# EAGLE design Jaw_Expansion_Board_V1_0 (2) (EAGLE 8.2.2)
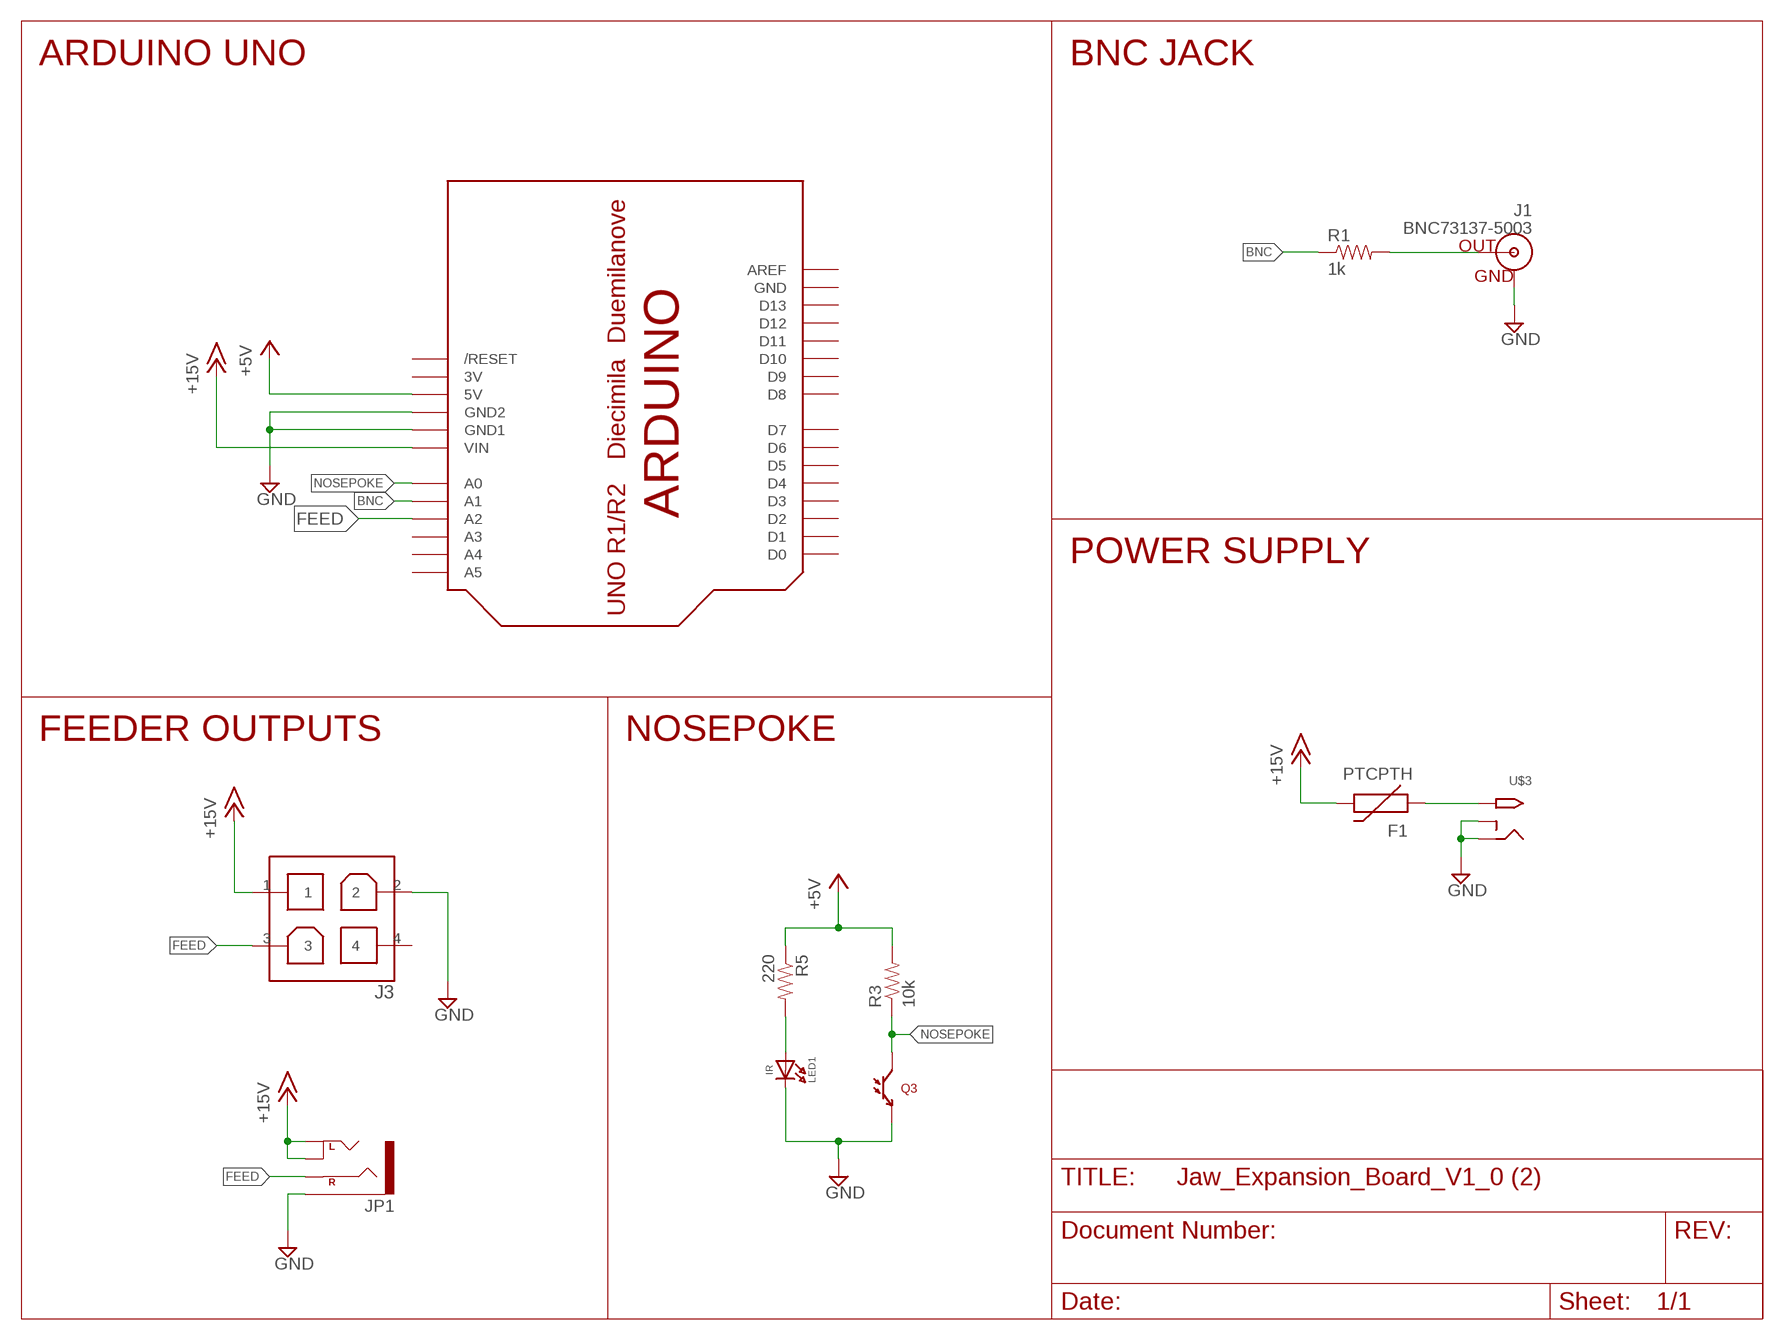
[diagram p0: schematic, sheet 1]

## Parts
F1  PTCPTH  [PTC]
J1  BNC73137-5003  [BNC_73137-5003]
J3  MOLEX_MINI-FIT_MALE_HEADER_2X2MOLEX_87427_MINI-FIT_2X2_RA  [MOLEX_87427_MINI-FIT_2X2_RA]
JP1  3.5MM_STEREORA  [161-3509-E]
LED1  IR  LTR-302  [LTR-301]
Q3  LTR-301  [LTR-301]
R1  1k  RESISTORPTH-1/4W  [AXIAL-0.4]
R3  10k  RESISTORPTH-1/4W  [AXIAL-0.4]
R5  220  RESISTORPTH-1/4W  [AXIAL-0.4]
U$1  ARDUINO_UNOUNO_NO_HOLES  [ARDUINO-NOHOLE]
U$3  2.1MMJACKTHM  [PJ-102A]

## Nets
+5V: R3.P$2 R5.P$1 U$1.5V
+15V [15V]: F1.P$2 J3.1 JP1.L2(LEFT2) JP1.L(LEFT1) U$1.VIN
BNC: R1.P$1 U$1.A1
FEED: J3.3 JP1.R(RIGHT) U$1.A2
GND: J1.GND J3.2 JP1.SHD LED1.-(C) Q3.-(E) U$1.GND1 U$1.GND2 U$3.RING U$3.RING_SW
N$1: J1.S(OUT) R1.P$2
N$3 [15V]: F1.P$1 U$3.TIP
N$6: LED1.+(A) R5.P$2
NOSEPOKE: Q3.+(C) R3.P$1 U$1.A0
Unconnected: J3.4 U$1.A3 U$1.A4 U$1.A5 U$1.AREF U$1.D0 U$1.D1 U$1.D2 U$1.D3 U$1.D4 U$1.D5 U$1.D6 U$1.D7 U$1.D8 U$1.D9 U$1.D10 U$1.D11 U$1.D12 U$1.D13 U$1.RESET(/RESET)

## Notes on the sheet
- ARDUINO UNO | BNC JACK
- POWER SUPPLY
- FEEDER OUTPUTS | NOSEPOKE

## Power pins joined to a net without a drawn wire
3V: U$1.3V
GND: U$1.GND

## Library data of the parts
F1 = SparkFun-PowerIC:PTC: Resettable Fuse PTC Resettable Fuse. Spark Fun Electronics SKU : COM-08357
J1 = vulintus:BNC: BNC Connector, Mouser Part# 5227161
J3 = vulintus:MOLEX_MINI-FIT_MALE_HEADER_2X2: Molex Mini-Fit Jr. Header, 4.20mm Pitch, Vertical, with Flange, 4 Circuits, without Mounting Flanges Part Number: 87427-0444
JP1 = vulintus:3.5MM_STEREO: 3.5mm Audio Jack Simple 3.5mm common PCB mount audio jack. Variant PTH is our storefront SKU PRT-08032
LED1 = vulintus:LTR-302: Through-hole side-sending IR emitter Pairs with IR phototransistoLTR-301
Q3 = vulintus:LTR-301: Through-hole side-receiving IR phototransistor Pairs with IR emitter LTR-302
R1 R3 R5 = vulintus:RESISTOR: Resistor Basic schematic elements and footprints for 0603, 1206, and PTH resistors.
U$1 = vulintus:ARDUINO_UNO: Arduino Diecimila/Duemilanove Make a shield with ease, this package has all the named pins as well as the two mounting drill holes and an outline of the USB and DC power connector. The outline is on the DIMENSION layer, so if your board house uses it they will cut the outline to match. http://www.ladyada.net/library/pcb/eaglelibrary.html
U$3 = vulintus:2.1MMJACK: 2.1mm x 5.5mm THM DC jack with internal switch. Digikey part #PJ-102A, 4UCON part #05537 2.1mm x 5.5mm SMT DC jack with internal switch. Digikey part #PJ-002A-SMT, 4UCON part #03267 By microbuilder.eu & adafruit.com

## Net classes
0 default: width 1.016 mm
1 15V: width 1.016 mm

## Board
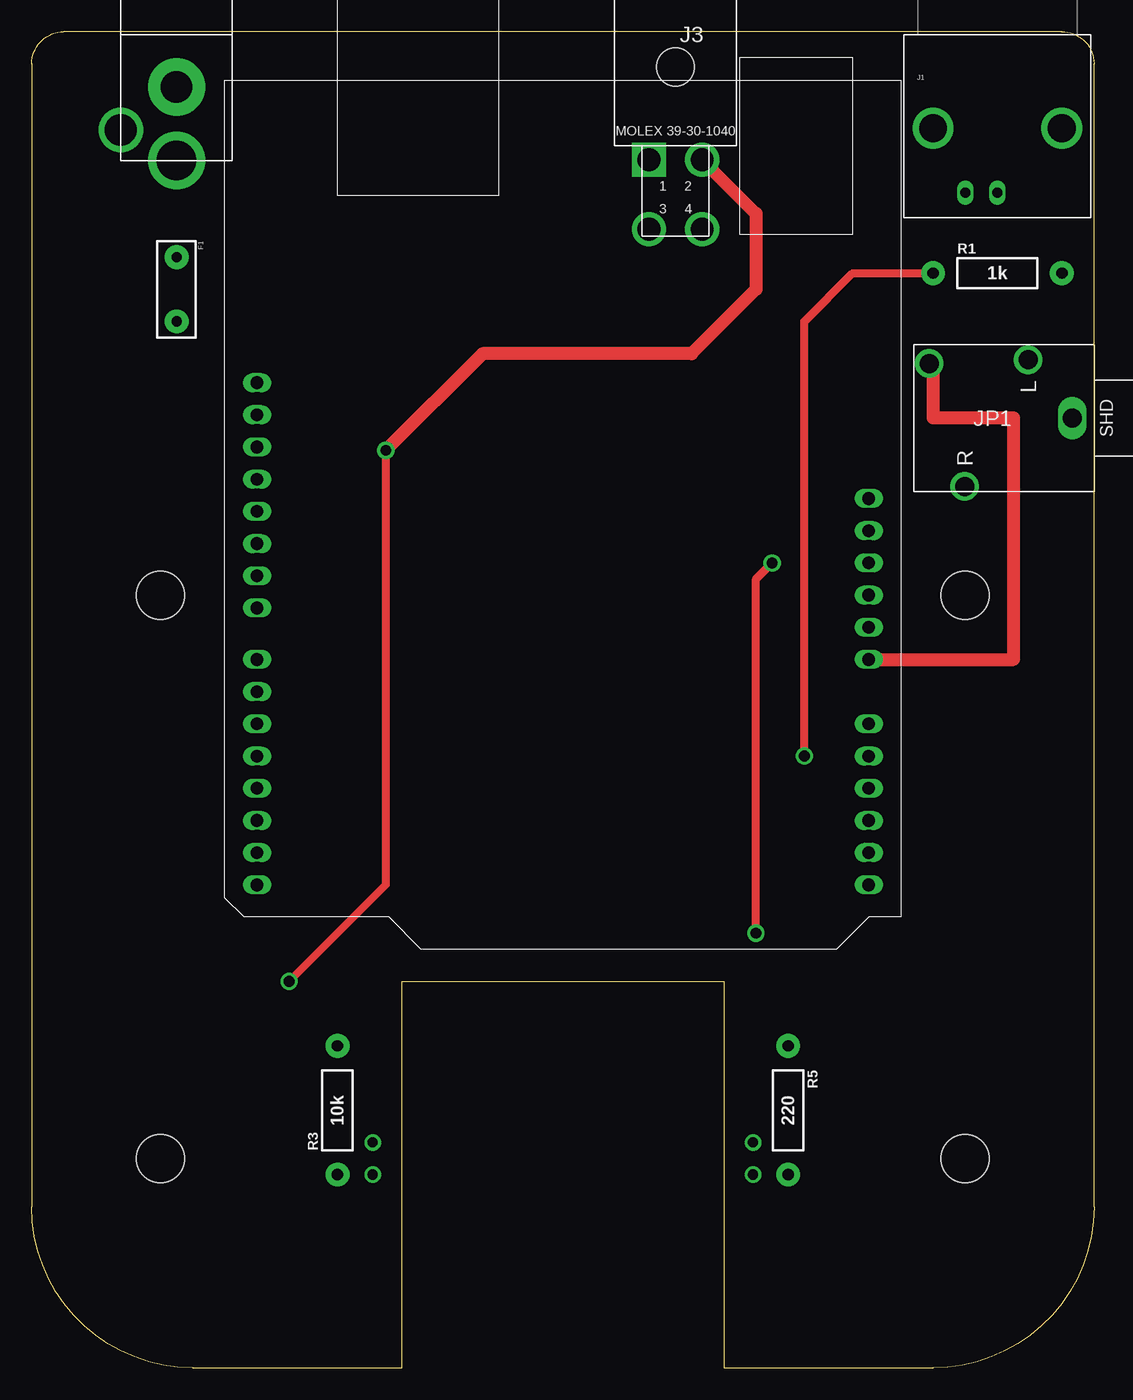
[diagram p1: board, top side]
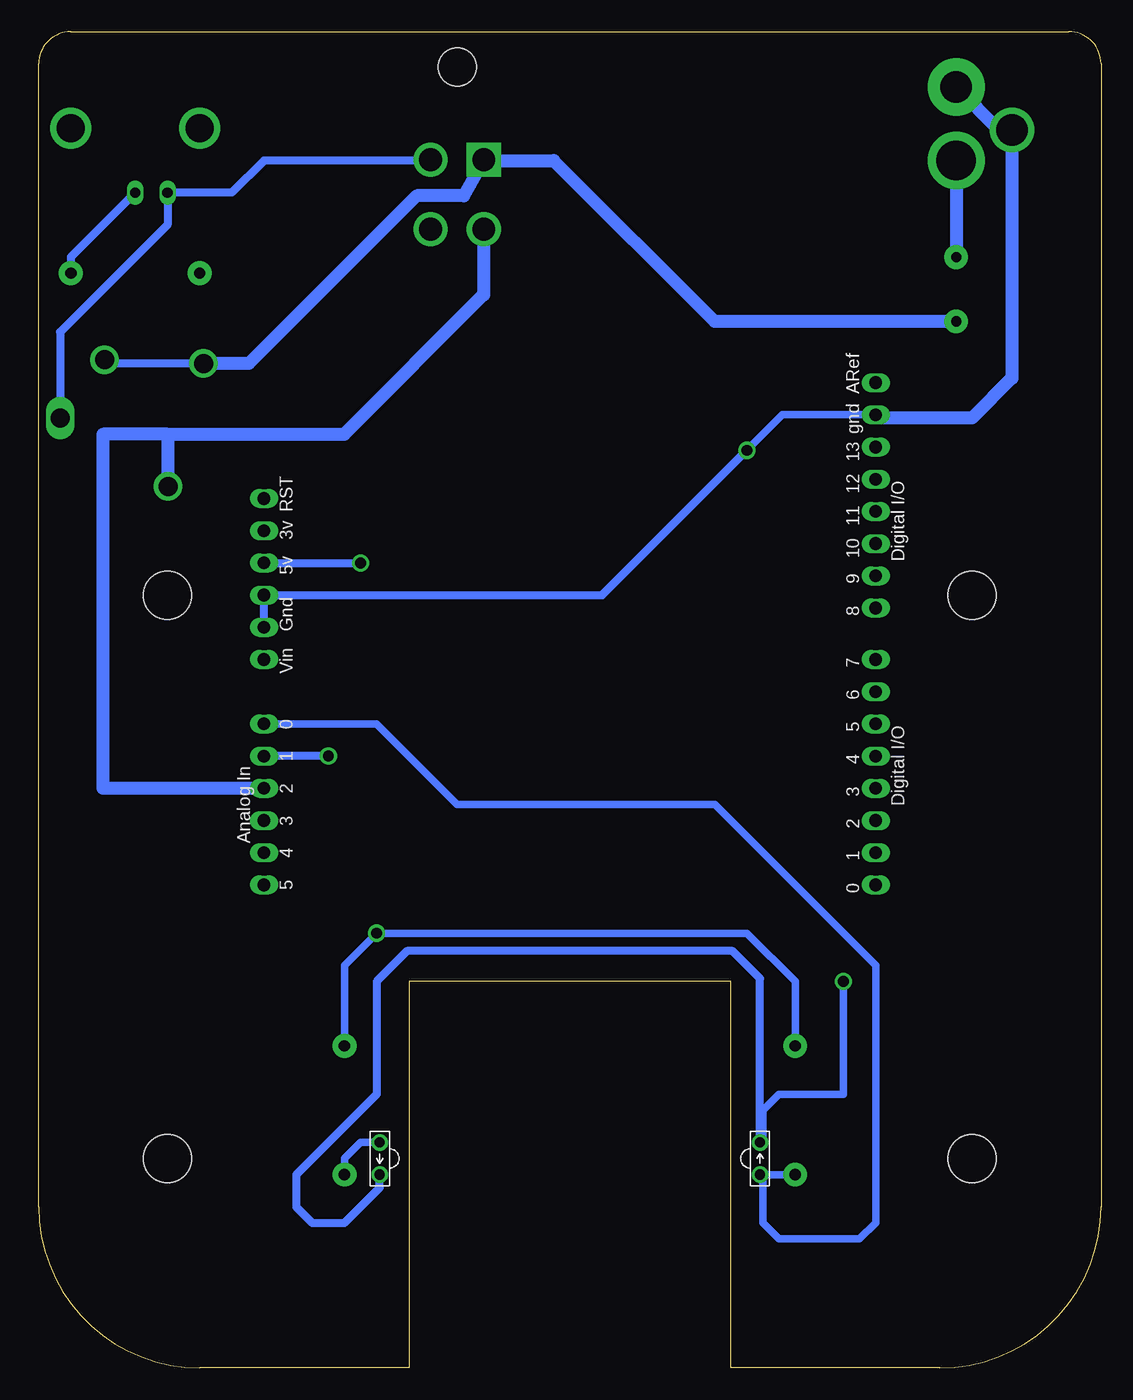
[diagram p2: board, bottom side, seen from below]

Size 83.82 x 105.41 mm. Coordinates in mm from the lower left corner, seen from the top.
Outline: 83.82,12.7 83.82,102.87 arc90 81.28,105.41 2.54,105.41 arc90 0,102.87 0,12.7 arc90 12.7,0 29.21,0 29.21,30.48 54.61,30.48 54.61,0 71.12,0 arc90 83.82,12.7
Copper layers (1*16): Top 0.035mm / dielectric 1.5mm / Bottom 0.035mm
Design rules "OthermillDRC_1_32_v2": minimum track width 8mil, minimum drill 0.8mm, track to track 0.794003125mm, track to pad 0.794003125mm, pad to pad 0.794003125mm, via to via 0.794003125mm, smd to smd 0mil, copper to edge 0mil, drill to drill 1mil, minimum pad ring 10mil, minimum via ring 10mil, stop-mask expansion 1mil, vias tented up to drill 30mil, thermal gap 10mil
Holes 3.81 mm at 73.66,16.51 10.16,16.51 73.66,60.96 10.16,60.96

### Footprints (pad centres in the part's own frame; a part is rotated, then mirrored left to right if it is on the bottom)
PTC = drill 0.8 pad 1.88: P$1 -2.54,0; P$2 2.54,0
BNC_73137-5003 = drill 2.2: 3 -5.08,5.08; 4 5.08,5.08 | drill 0.8 long: GND -2.54,0; S 0,0
MOLEX_87427_MINI-FIT_2X2_RA = drill 1.8 square: 1 2.1,13.9 | drill 1.8: 2 -2.1,13.9; 3 2.1,19.4; 4 -2.1,19.4 | hole 3: 0,6.6
161-3509-E = drill 1.5: L 4.6,5.2; L2 4.3,13; R -5.4,10.2 | drill 1.5 long: SHD 0,1.7
LTR-301 = drill 0.8: + 1.27,0; - -1.27,0
AXIAL-0.4 = drill 0.9 pad 1.88: P$1 -5.08,0; P$2 5.08,0
ARDUINO-NOHOLE = drill 1 long: 3V 35.56,2.54; 5V 38.1,2.54; A0 50.8,2.54; A1 53.34,2.54; A2 55.88,2.54; A3 58.42,2.54; A4 60.96,2.54; A5 63.5,2.54; AREF 23.876,50.8; D0 63.5,50.8; D1 60.96,50.8; D2 58.42,50.8; D3 55.88,50.8; D4 53.34,50.8; D5 50.8,50.8; D6 48.26,50.8; D7 45.72,50.8; D8 41.656,50.8; D9 39.116,50.8; D10 36.576,50.8; D11 34.036,50.8; D12 31.496,50.8; D13 28.956,50.8; GND 26.416,50.8; GND1 43.18,2.54; GND2 40.64,2.54; RESET 33.02,2.54; VIN 45.72,2.54
PJ-102A = drill 2.5 pad 4.5: RING 0,5.8 | drill 2.5: RING_SW -4.4,2.4 | drill 3.1 pad 4.5: TIP 0,0

### Placement (x,y rotation side)
F1  11.43,85.09 270 top
J1  76.2,92.71 0 top
J3  50.8,109.22 180 top
JP1  83.82,74.93 90 top
LED1  56.91,16.51 90 bottom
Q3  26.91,16.51 270 bottom
R1  76.2,86.36 0 top
R3  24.13,20.32 90 top
R5  59.69,20.32 270 top
U$1  68.58,101.6 270 bottom
U$3  11.43,95.25 0 top

### Tracks (layer width: path | path; a pad name or v marks a point on that pad's centre or on a via)
+5V  (via drill 0.85)
  Top 0.635: v58.42,63.5 57.15,62.23 v57.15,34.29
  Bottom 0.61: R3.P$2 24.13,30.48 27.94,34.29 v57.15,34.29 59.69,31.75 R5.P$1
  Bottom 0.635: U$1.5V v58.42,63.5
+15V
  Top 1.016: U$1.VIN 77.47,55.88 77.47,74.93 71.12,74.93 71.12,78.93 JP1.L2
  Bottom 0.635: JP1.L 78.32,79.23 71.12,79.23 JP1.L2 | 49.16,94.48 48.7,94.95 J3.1 48.33,95.32 48.26,95.25
  Bottom 1.016: F1.P$2 30.48,82.55 43.18,95.25 48.26,95.25 | 49.16,94.48 50.28,92.47 54,92.47 67.24,79.23 71.12,79.23
BNC  (via drill 0.85)
  Top 0.635: v60.96,48.26 60.96,82.55 64.77,86.36 R1.P$1
  Bottom 0.635: v60.96,48.26 U$1.A1
FEED
  Bottom 1.016: J3.3 48.7,84.65 59.69,73.66 73.66,73.66 | U$1.A2 78.74,45.72 78.74,73.66 73.66,73.66 | JP1.R 73.62,73.62 73.66,73.66
GND  (via drill 0.85)
  Top 0.61: v20.32,30.48 27.94,38.1
  Top 0.635: v27.94,72.39 27.94,38.1
  Top 1.016: J3.2 57.15,91.07 57.15,85.09 52.07,80.01 35.56,80.01 v27.94,72.39
  Bottom 0.61: Q3.- 26.67,18.02 26.67,20.32 25.4,21.59 20.32,21.59 v20.32,30.48 | U$1.GND 25.15,75.18 v27.94,72.39
  Bottom 0.635: U$1.GND1 U$1.GND2 39.37,60.96 v27.94,72.39 | JP1.SHD 82.12,81.71 73.66,90.17 J1.GND 68.58,92.71 66.04,95.25 52.97,95.25 J3.2 | Q3.- 26.91,30.72 29.06,32.87 54.76,32.87 57.15,30.48 57.15,21.59 63.5,15.24 63.5,12.7 62.23,11.43 59.69,11.43 56.91,14.21 LED1.-
  Bottom 1.016: U$3.RING 8.03,97.65 U$3.RING_SW 7.03,78.06 10.16,74.93 17.53,74.93 U$1.GND
N$1
  Bottom 0.635: J1.S 81.28,87.63 R1.P$2
N$3
  Bottom 1.016: U$3.TIP F1.P$1
N$6
  Bottom 0.61: R5.P$2 59.69,16.51 58.42,17.78 LED1.+
NOSEPOKE
  Bottom 0.61: R3.P$1 Q3.+ 26.67,15 26.67,11.43 25.4,10.16 19.05,10.16 17.78,11.43 17.78,31.75 30.48,44.45 50.8,44.45 57.15,50.8 U$1.A0